# EAGLE design usbMIDI2CV_MC (EAGLE 8.3.2)
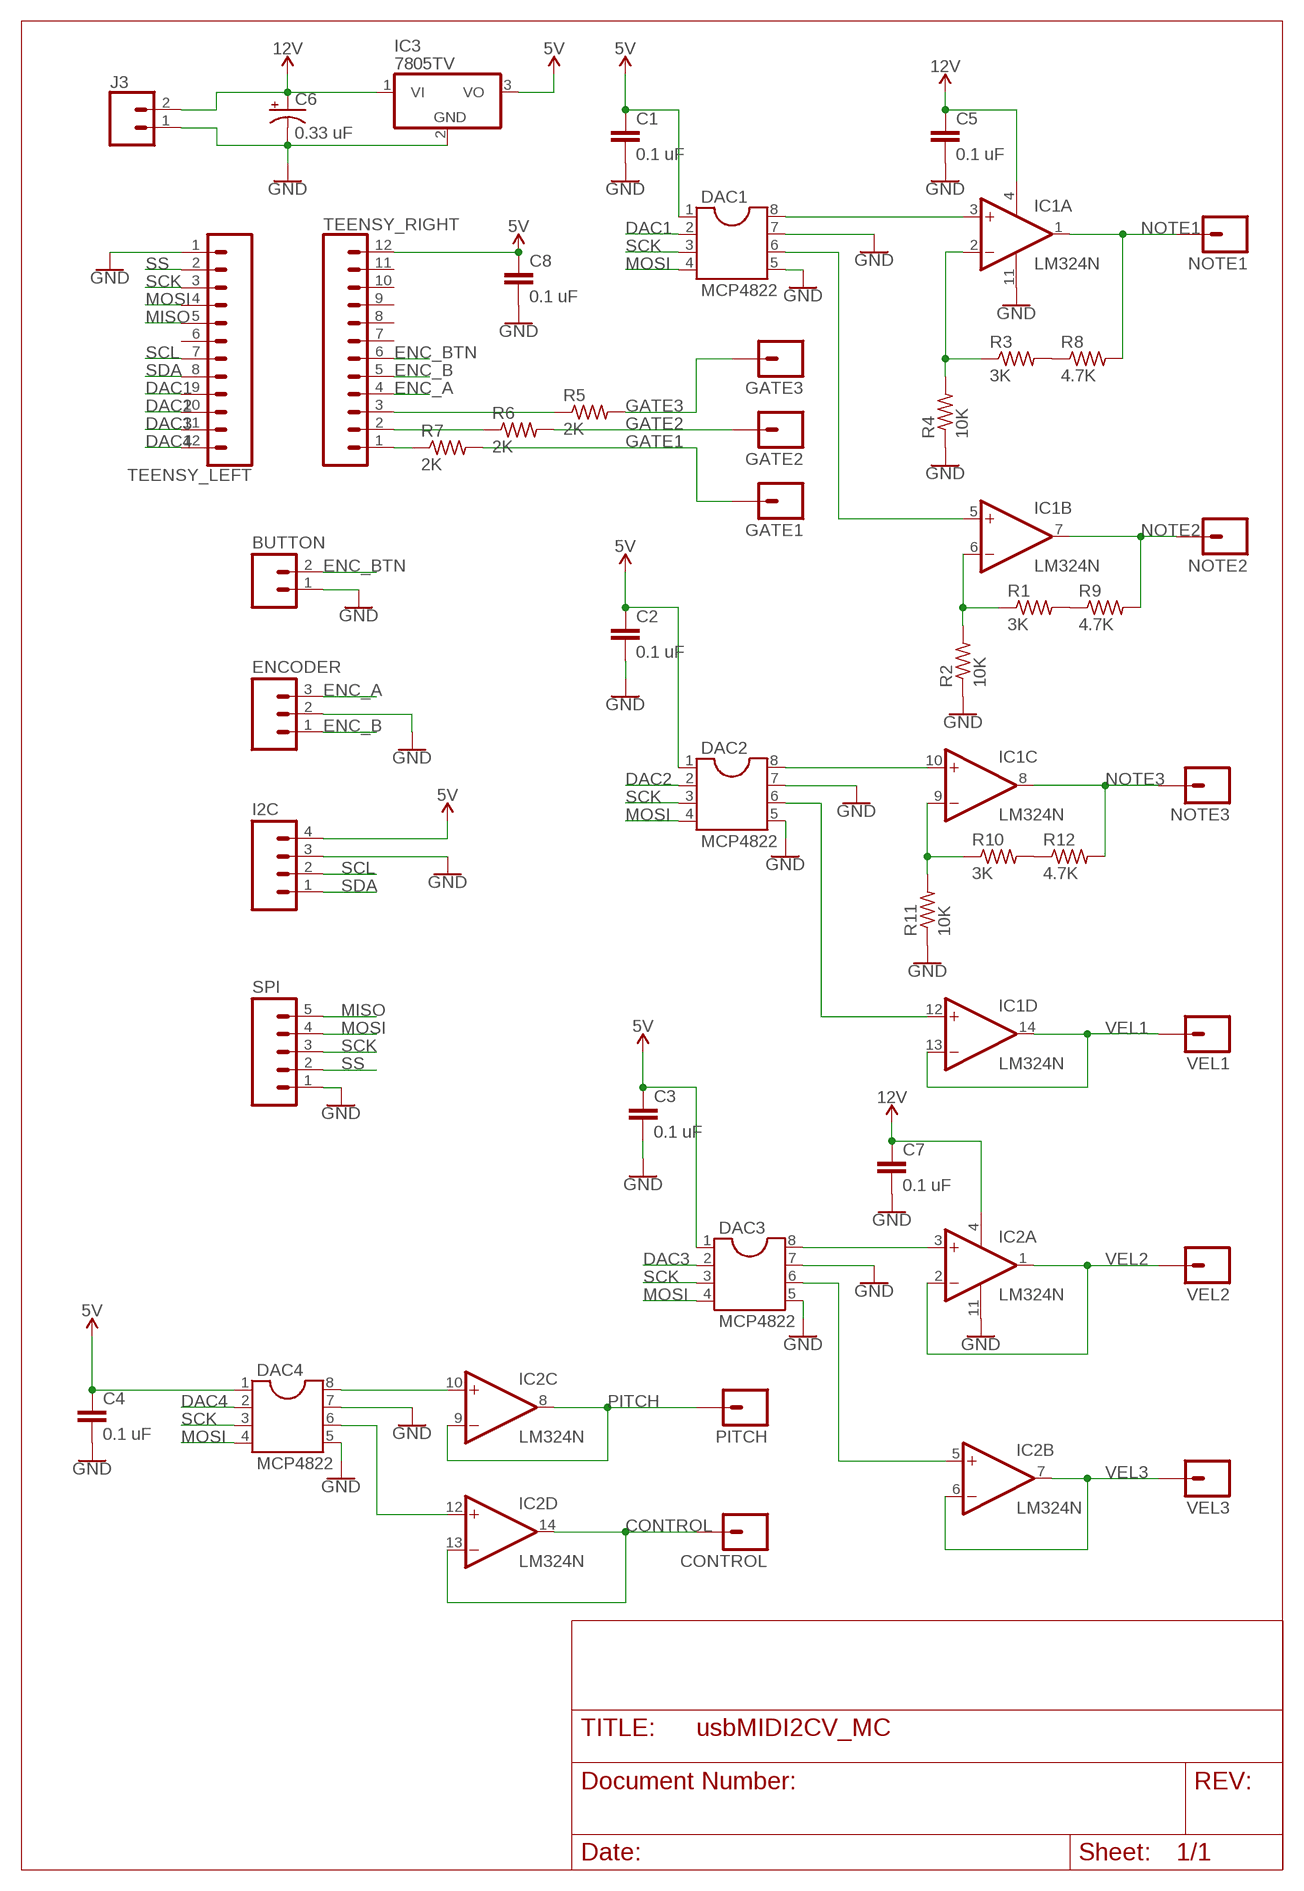
[diagram p0: schematic, sheet 1]

## Parts
BUTTON  M02LOCK_LONGPADS  [1X02_LOCK_LONGPADS]
C1  0.1 uF  CAPPTH  [CAP-PTH-SMALL]
C2  0.1 uF  CAPPTH  [CAP-PTH-SMALL]
C3  0.1 uF  CAPPTH  [CAP-PTH-SMALL]
C4  0.1 uF  CAPPTH  [CAP-PTH-SMALL]
C5  0.1 uF  CAPPTH  [CAP-PTH-SMALL]
C6  0.33 uF  CAP_POLPTH1  [CPOL-RADIAL-100UF-25V]
C7  0.1 uF  CAPPTH  [CAP-PTH-SMALL]
C8  0.1 uF  CAPPTH  [CAP-PTH-SMALL]
CONTROL  M01PTH_NO_SILK_YES_STOP  [1X01_NO_SILK]
DAC1  MCP4822  DIL8S  [SOCKET-08]
DAC2  MCP4822  DIL8S  [SOCKET-08]
DAC3  MCP4822  DIL8S  [SOCKET-08]
DAC4  MCP4822  DIL8S  [SOCKET-08]
ENCODER  M03LONGPADS  [1X03_LONGPADS]
GATE1  M01PTH_NO_SILK_YES_STOP  [1X01_NO_SILK]
GATE2  M01PTH_NO_SILK_YES_STOP  [1X01_NO_SILK]
GATE3  M01PTH_NO_SILK_YES_STOP  [1X01_NO_SILK]
I2C  M04LONGPADS  [1X04_LONGPADS]
IC1  LM324N  [DIL14]
IC2  LM324N  [DIL14]
IC3  7805TV  [TO220V]
J3  CONN_025MM  [SCREWTERMINAL-5MM-2]
NOTE1  M01PTH_NO_SILK_YES_STOP  [1X01_NO_SILK]
NOTE2  M01PTH_NO_SILK_YES_STOP  [1X01_NO_SILK]
NOTE3  M01PTH_NO_SILK_YES_STOP  [1X01_NO_SILK]
PITCH  M01PTH_NO_SILK_YES_STOP  [1X01_NO_SILK]
R1  3K  R-US_0207/10  [0207/10]
R2  10K  R-US_0207/10  [0207/10]
R3  3K  R-US_0207/10  [0207/10]
R4  10K  R-US_0207/10  [0207/10]
R5  2K  R-US_0207/10  [0207/10]
R6  2K  R-US_0207/10  [0207/10]
R7  2K  R-US_0207/10  [0207/10]
R8  4.7K  R-US_0207/10  [0207/10]
R9  4.7K  R-US_0207/10  [0207/10]
R10  3K  R-US_0207/10  [0207/10]
R11  10K  R-US_0207/10  [0207/10]
R12  4.7K  R-US_0207/10  [0207/10]
SPI  M05PTH_LONGPADS  [1X05_LONGPADS]
TEENSY_LEFT  CONN_12  [1X12]
TEENSY_RIGHT  CONN_12  [1X12]
VEL1  M01PTH_NO_SILK_YES_STOP  [1X01_NO_SILK]
VEL2  M01PTH_NO_SILK_YES_STOP  [1X01_NO_SILK]
VEL3  M01PTH_NO_SILK_YES_STOP  [1X01_NO_SILK]

## Nets
5V: C1.1 C2.1 C3.1 C4.1 C8.1 DAC1.1 DAC2.1 DAC3.1 DAC4.1 I2C.4 IC3.3(VO) TEENSY_RIGHT.12
12V: C5.1 C6.1(+) C7.1 IC1.4(P:V+) IC2.4(P:V+) IC3.1(VI) J3.2
CONTROL: CONTROL.1 IC2.13(D:-IN) IC2.14(D:OUT)
DAC1: DAC1.2 TEENSY_LEFT.9
DAC2: DAC2.2 TEENSY_LEFT.10
DAC3: DAC3.2 TEENSY_LEFT.11
DAC4: DAC4.2 TEENSY_LEFT.12
ENC_A: ENCODER.3 TEENSY_RIGHT.4
ENC_B: ENCODER.1 TEENSY_RIGHT.5
ENC_BTN: BUTTON.2 TEENSY_RIGHT.6
GATE1: GATE1.1 R7.2
GATE2: GATE2.1 R6.2
GATE3: GATE3.1 R5.2
GND: BUTTON.1 C1.2 C2.2 C3.2 C4.2 C5.2 C6.2(-) C7.2 C8.2 DAC1.5 DAC1.7 DAC2.5 DAC2.7 DAC3.5 DAC3.7 DAC4.5 DAC4.7 ENCODER.2 I2C.3 IC1.11(P:V-) IC2.11(P:V-) IC3.2(GND) J3.1 R2.1 R4.1 R11.1 SPI.1 TEENSY_LEFT.1
MISO: SPI.5 TEENSY_LEFT.5
MOSI: DAC1.4 DAC2.4 DAC3.4 DAC4.4 SPI.4 TEENSY_LEFT.4
N$1: IC1.6(B:-IN) R1.1 R2.2
N$2: R1.2 R9.1
N$3: IC1.9(C:-IN) R10.1 R11.2
N$4: DAC1.8 IC1.3(A:+IN)
N$5: R3.2 R8.1
N$6: IC1.2(A:-IN) R3.1 R4.2
N$7: DAC1.6 IC1.5(B:+IN)
N$8: DAC2.8 IC1.10(C:+IN)
N$9: DAC2.6 IC1.12(D:+IN)
N$10: R10.2 R12.1
N$11: DAC3.8 IC2.3(A:+IN)
N$12: R5.1 TEENSY_RIGHT.3
N$13: DAC3.6 IC2.5(B:+IN)
N$14: DAC4.6 IC2.12(D:+IN)
N$15: DAC4.8 IC2.10(C:+IN)
N$16: R6.1 TEENSY_RIGHT.2
N$17: R7.1 TEENSY_RIGHT.1
NOTE1: IC1.1(A:OUT) NOTE1.1 R8.2
NOTE2: IC1.7(B:OUT) NOTE2.1 R9.2
NOTE3: IC1.8(C:OUT) NOTE3.1 R12.2
PITCH: IC2.8(C:OUT) IC2.9(C:-IN) PITCH.1
SCK: DAC1.3 DAC2.3 DAC3.3 DAC4.3 SPI.3 TEENSY_LEFT.3
SCL: I2C.2 TEENSY_LEFT.7
SDA: I2C.1 TEENSY_LEFT.8
SS: SPI.2 TEENSY_LEFT.2
VEL1: IC1.13(D:-IN) IC1.14(D:OUT) VEL1.1
VEL2: IC2.1(A:OUT) IC2.2(A:-IN) VEL2.1
VEL3: IC2.6(B:-IN) IC2.7(B:OUT) VEL3.1
Unconnected: TEENSY_LEFT.6 TEENSY_RIGHT.7 TEENSY_RIGHT.8 TEENSY_RIGHT.9 TEENSY_RIGHT.10 TEENSY_RIGHT.11

## Library data of the parts
BUTTON = SparkFun-Connectors:M02: Standard 2-pin 0.1" header. Use with - straight break away headers ( PRT-00116) - right angle break away headers (PRT-00553) - swiss pins (PRT-00743) - machine pins (PRT-00117) - female headers (PRT-00115) Molex polarized connector foot print use with: PRT-08233 with associated crimp pins and housings. 2.54_SCREWTERM for use with PRT-10571. 3.5mm Screw Terminal footprints for PRT-08084 5mm Screw Terminal footprints for use with PRT-08432
C1-C5 C7 C8 = SparkFun-Capacitors:CAP: Capacitor Standard 0603 ceramic capacitor, and 0.1" leaded capacitor.
C6 = SparkFun-Capacitors:CAP_POL: Capacitor Polarized These are standard SMD and PTH capacitors. Normally 10uF, 47uF, and 100uF in electrolytic and tantalum varieties. Always verify the external diameter of the through hole cap, it varies with capacity, voltage, and manufacturer. The EIA devices should be standard.
CONTROL GATE1-GATE3 NOTE1-NOTE3 PITCH VEL1-VEL3 = SparkFun-Connectors:M01: Header 1 Standard 1-pin 0.1" header. Use with straight break away headers (SKU : PRT-00116), right angle break away headers (PRT-00553), swiss pins (PRT-00743), machine pins (PRT-00117), and female headers (PRT-00115). SMTSO-256-ET is a "flush mount" nut for a 4-40 screw. The older package used to be too tight, and did not allow it to sit properly thru the drill hit. The latest (0.165DIA) fits nice and snug.
DAC1-DAC4 = ic-package:DIL8: Dual In Line / Socket
ENCODER = SparkFun-Connectors:M03: Header 3 Standard 3-pin 0.1" header. Use with straight break away headers (SKU : PRT-00116), right angle break away headers (PRT-00553), swiss pins (PRT-00743), machine pins (PRT-00117), and female headers (PRT-00115). Molex polarized connector foot print use with SKU : PRT-08232 with associated crimp pins and housings.
I2C = SparkFun-Connectors:M04: Header 4 Standard 4-pin 0.1" header. Use with straight break away headers (SKU : PRT-00116), right angle break away headers (PRT-00553), swiss pins (PRT-00743), machine pins (PRT-00117), and female headers (PRT-00115). Molex polarized connector foot print use with SKU : PRT-08231 with associated crimp pins and housings. 1MM SMD Version SKU: PRT-10208; PROD_ID: CONN-09696
IC1 IC2 = linear:LM324: OP AMP
IC3 = linear:78*: Positive VOLTAGE REGULATOR Source: http://cache.national.com/ds/LM/LM78L05.pdf http://www.fairchildsemi.com/ds/LM/LM7805.pdf
J3 = SparkFun-Connectors:CONN_02: Multi connection point. Often used as Generic Header-pin footprint for 0.1 inch spaced/style header connections On any of the 0.1 inch spaced packages, you can populate with these: Break Away Headers - Straight <https://www.sparkfun.com/products/116> (PRT-00116) Break Away Male Headers - Right Angle <https://www.sparkfun.com/products/553> (PRT-00553) Female Headers <https://www.sparkfun.com/products/115> (PRT-00115) Break Away Headers - Machine Pin <https://www.sparkfun.com/products/117> (PRT-00117) Break Away Female Headers - Swiss Machine Pin <https://www.sparkfun.com/products/743> (PRT-00743) For SCREWTERMINALS and SPRING TERMINALS visit here: Screw Terimnals on SparkFun.com <https://www.sparkfun.com/search/results?term=Screw+Terminals> (5mm/3.5mm/2.54mm spacing) This device is also useful as a general connection point to wire up your design to another part of your project. Our various solder wires solder well into these plated through hole pads. Hook-Up Wire - Assortment (Stranded, 22 AWG) <https://www.sparkfun.com/products/11375> (PRT-11375) Hook-Up Wire - Assortment (Solid Core, 22 AWG) <https://www.sparkfun.com/products/11367> (PRT-11367) View the entire wire category on our website here <https://www.sparkfun.com/categories/141> Special notes: Molex polarized connector foot print use with: PRT-08233 with associated crimp pins and housings. 2.54_SCREWTERM for use with PRT-10571. 3.5mm Screw Terminal footprints for PRT-08084 5mm Screw Terminal footprints for use with PRT-08432; SF_SKU: PRT-08432
R1-R12 = resistor:R-US_: RESISTOR, American symbol
SPI = SparkFun-Connectors:M05: Header 5 Standard 5-pin 0.1" header. Use with straight break away headers (SKU : PRT-00116), right angle break away headers (PRT-00553), swiss pins (PRT-00743), machine pins (PRT-00117), and female headers (PRT-00115). Molex polarized connector foot print use with SKU : PRT-08230 with associated crimp pins and housings.
TEENSY_LEFT TEENSY_RIGHT = SparkFun-Connectors:CONN_12: Multi connection point. Often used as Generic Header-pin footprint for 0.1 inch spaced/style header connections On any of the 0.1 inch spaced packages, you can populate with these: Break Away Headers - Straight <https://www.sparkfun.com/products/116> (PRT-00116) Break Away Male Headers - Right Angle <https://www.sparkfun.com/products/553> (PRT-00553) Female Headers <https://www.sparkfun.com/products/115> (PRT-00115) Break Away Headers - Machine Pin <https://www.sparkfun.com/products/117> (PRT-00117) Break Away Female Headers - Swiss Machine Pin <https://www.sparkfun.com/products/743> (PRT-00743) For SCREWTERMINALS and SPRING TERMINALS visit here: Screw Terimnals on SparkFun.com <https://www.sparkfun.com/search/results?term=Screw+Terminals> (5mm/3.5mm/2.54mm spacing) This device is also useful as a general connection point to wire up your design to another part of your project. Our various solder wires solder well into these plated through hole pads. Hook-Up Wire - Assortment (Stranded, 22 AWG) <https://www.sparkfun.com/products/11375> (PRT-11375) Hook-Up Wire - Assortment (Solid Core, 22 AWG) <https://www.sparkfun.com/products/11367> (PRT-11367) View the entire wire category on our website here <https://www.sparkfun.com/categories/141> Special notes: Molex polarized connector foot print use with SKU : PRT-08231 with associated crimp pins and housings. 1MM SMD Version SKU: PRT-10208 NOTES ON THE VARIANTS LOCK and LOCK_LONGPADS... This footprint was designed to help hold the alignment of a through-hole component (i.e. 6-pin header) while soldering it into place. You may notice that each hole has been shifted either up or down by 0.005 of an inch from it's more standard position (which is a perfectly straight line). This slight alteration caused the pins (the squares in the middle) to touch the edges of the holes. Because they are alternating, it causes a "brace" to hold the component in place. 0.005 has proven to be the perfect amount of "off-center" position when using our standard breakaway headers. Although looks a little odd when you look at the bare footprint, once you have a header in there, the alteration is very hard to notice. Also,if you push a header all the way into place, it is covered up entirely on the bottom side.

## Board
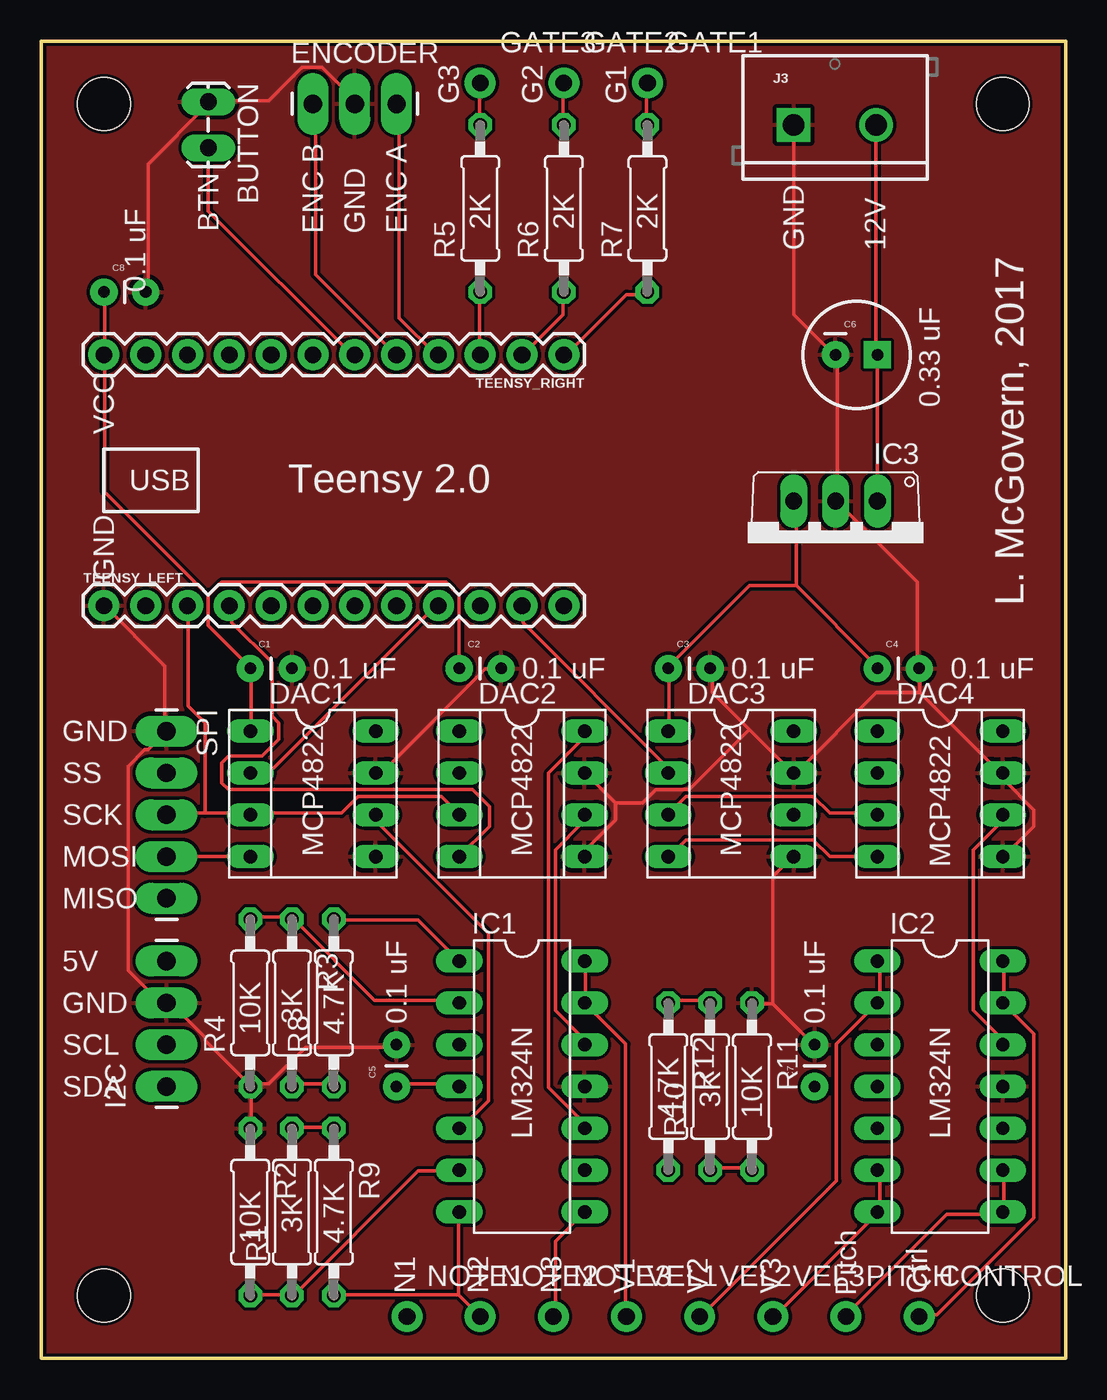
[diagram p1: board, top side]
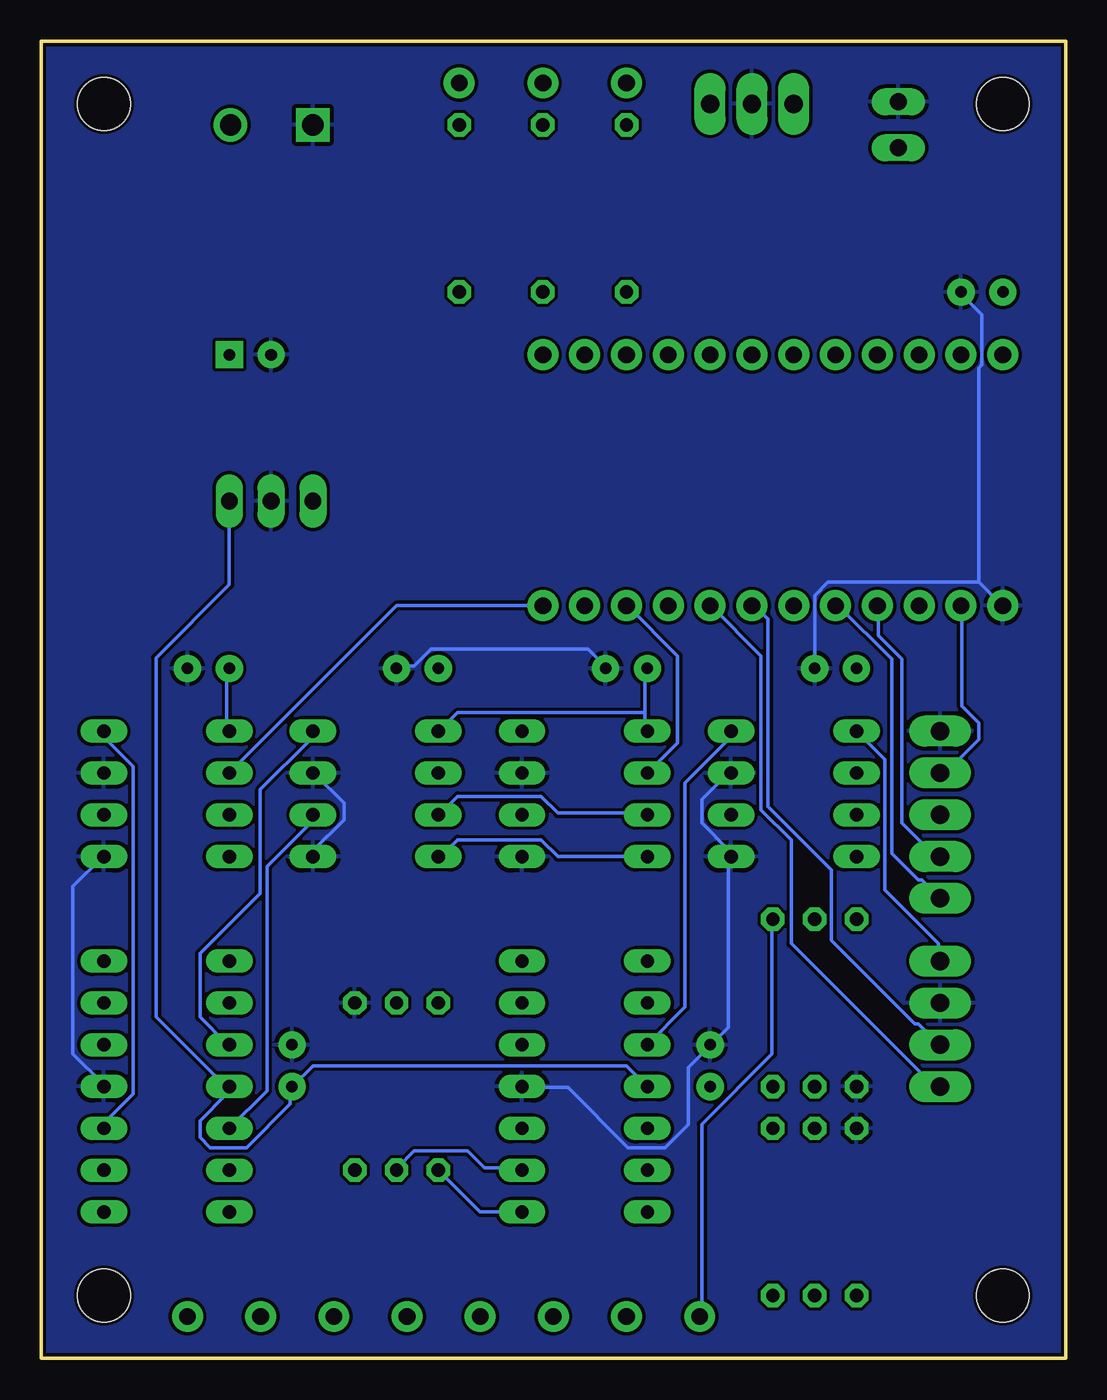
[diagram p2: board, bottom side, seen from below]

Size 62.23 x 80.01 mm. Coordinates in mm from the lower left corner, seen from the top.
Outline: 3.81,0 62.23,0
Outline: 62.23,0 0,0 0,80.01 62.23,80.01 62.23,0
Copper layers (1*16): Top 0.035mm / dielectric 1.5mm / Bottom 0.035mm
Design rules "SparkFun": minimum track width 8mil, minimum drill 20mil, track to track 8mil, track to pad 8mil, pad to pad 8mil, via to via 8mil, smd to smd 8mil, copper to edge 8mil, drill to drill 8mil, minimum pad ring 12mil, minimum via ring 10mil, stop-mask expansion 4mil, vias tented up to drill 20mil, thermal gap 10mil
Holes 3.2 mm at 3.81,3.81 58.42,3.81 58.42,76.2 3.81,76.2

### Footprints (pad centres in the part's own frame; a part is rotated, then mirrored left to right if it is on the bottom)
1X02_LOCK_LONGPADS = drill 1.016 long: 1 -0.127,0; 2 2.667,0
CAP-PTH-SMALL = drill 0.7 pad 1.651: 1 0,0; 2 2.54,0
CPOL-RADIAL-100UF-25V = drill 0.7 pad 1.651 square: 1 1.27,0 | drill 0.7 pad 1.651: 2 -1.27,0
1X01_NO_SILK = drill 1.016 pad 1.88: 1 0,0
SOCKET-08 = drill 0.813 long: 1 -3.81,-3.81; 2 -1.27,-3.81; 3 1.27,-3.81; 4 3.81,-3.81; 5 3.81,3.81; 6 1.27,3.81; 7 -1.27,3.81; 8 -3.81,3.81
1X03_LONGPADS = drill 1.118 pad 1.88 long: 1 0,0; 2 2.54,0; 3 5.08,0
1X04_LONGPADS = drill 1.118 pad 1.88 long: 1 0,0; 2 2.54,0; 3 5.08,0; 4 7.62,0
DIL14 = drill 0.813 long: 1 -7.62,-3.81; 2 -5.08,-3.81; 3 -2.54,-3.81; 4 0,-3.81; 5 2.54,-3.81; 6 5.08,-3.81; 7 7.62,-3.81; 8 7.62,3.81; 9 5.08,3.81; 10 2.54,3.81; 11 0,3.81; 12 -2.54,3.81; 13 -5.08,3.81; 14 -7.62,3.81
TO220V = drill 1.016 long: 1 -2.54,-2.54; 2 0,-2.54; 3 2.54,-2.54
SCREWTERMINAL-5MM-2 = drill 1.3 pad 2.032 square: 1 0,0 | drill 1.3 pad 2.032: 2 5,0
0207/10 = drill 0.813 octagon: 1 -5.08,0; 2 5.08,0
1X05_LONGPADS = drill 1.118 pad 1.88 long: 1 0,0; 2 2.54,0; 3 5.08,0; 4 7.62,0; 5 10.16,0
1X12 = drill 1.016 pad 1.88: 1 0,0; 2 2.54,0; 3 5.08,0; 4 7.62,0; 5 10.16,0; 6 12.7,0; 7 15.24,0; 8 17.78,0; 9 20.32,0; 10 22.86,0; 11 25.4,0; 12 27.94,0

### Placement (x,y rotation side)
BUTTON  10.16,76.2 270 top
C1  12.7,41.91 0 top
C2  25.4,41.91 0 top
C3  38.1,41.91 0 top
C4  50.8,41.91 0 top
C5  21.59,16.51 90 top
C6  49.53,60.96 0 top
C7  46.99,16.51 90 top
C8  3.81,64.77 0 top
CONTROL  53.34,2.54 0 top
DAC1  16.51,34.29 270 top
DAC2  29.21,34.29 270 top
DAC3  41.91,34.29 270 top
DAC4  54.61,34.29 270 top
ENCODER  16.51,76.2 0 top
GATE1  36.83,77.47 0 top
GATE2  31.75,77.47 0 top
GATE3  26.67,77.47 0 top
I2C  7.62,16.51 90 top
IC1  29.21,16.51 270 top
IC2  54.61,16.51 270 top
IC3  48.26,49.53 180 top
J3  45.72,74.93 0 top
NOTE1  22.23,2.54 0 top
NOTE2  26.67,2.54 0 top
NOTE3  31.11,2.54 0 top
PITCH  48.9,2.54 0 top
R1  15.24,8.89 90 top
R2  12.7,8.89 270 top
R3  15.24,21.59 270 top
R4  12.7,21.59 90 top
R5  26.67,69.85 90 top
R6  31.75,69.85 90 top
R7  36.83,69.85 90 top
R8  17.78,21.59 90 top
R9  17.78,8.89 270 top
R10  40.64,16.51 90 top
R11  43.18,16.51 270 top
R12  38.1,16.51 270 top
SPI  7.62,38.1 270 top
TEENSY_LEFT  3.81,45.72 0 top
TEENSY_RIGHT  31.75,60.96 180 top
VEL1  35.56,2.54 0 top
VEL2  40.01,2.54 0 top
VEL3  44.45,2.54 0 top

### Tracks (layer width: path | path; a pad name or v marks a point on that pad's centre or on a via)
5V
  Top 0.203: DAC3.1 38.15,38.2 38.15,41.86 C3.1 38.15,42.06 43.03,46.94 45.87,46.94 | DAC1.1 12.75,38.2 12.75,41.86 C1.1 12.6,42.06 10.16,44.5 10.16,46.33 | 45.87,46.94 45.87,52.02 IC3.3 | 45.87,46.94 50.75,42.06 C4.1 | 3.86,60.96 3.86,64.62 C8.1 | 3.86,60.96 3.86,52.63 10.16,46.33 | 3.86,60.96 TEENSY_RIGHT.12 | C2.1 25.4,46.33 24.59,47.14 10.97,47.14 10.16,46.33
  Bottom 0.203: DAC4.1 50.95,38.2 50.95,41.86 C4.1 | 25.55,39.22 25.55,41.86 C2.1 | 25.55,39.22 25.55,38.2 DAC2.1 | 25.55,39.22 36.93,39.22 37.95,38.2 DAC3.1 | DAC1.1 10.97,36.37 10.97,28.45 7.72,25.2 7.72,24.18 I2C.4
12V
  Top 0.203: IC1.4 25.35,16.66 21.69,16.66 C5.1 | J3.2 50.72,61.04 C6.1 IC3.1
  Bottom 0.203: 50.95,16.46 50.95,16.05 52.58,14.43 52.58,13.41 51.97,12.8 49.73,12.8 47.09,15.44 47.09,16.46 C7.1 45.72,17.78 26.67,17.78 IC1.4 | 50.95,16.46 IC2.4 | IC3.1 50.8,46.99 55.24,42.55 55.24,20.75 50.95,16.46
CONTROL
  Top 0.203: IC2.14 58.47,23.98 58.47,21.74 IC2.13 60.3,19.71 60.3,8.53 54.41,2.64 53.39,2.64 CONTROL.1
DAC1
  Top 0.203: DAC1.2 13.82,35.56 23.98,45.72 TEENSY_LEFT.9
DAC2
  Bottom 0.203: DAC2.2 23.57,37.39 23.57,42.67 26.62,45.72 TEENSY_LEFT.10
DAC3
  Top 0.203: DAC3.2 38,35.56 38,35.97 29.26,44.7 29.26,45.72 TEENSY_LEFT.11
DAC4
  Bottom 0.203: DAC4.2 40.64,45.72 TEENSY_LEFT.12
ENC_A
  Top 0.203: ENCODER.3 21.74,76.2 21.74,63.2 23.98,60.96 TEENSY_RIGHT.4
ENC_B
  Top 0.203: ENCODER.1 16.66,76.2 16.66,65.84 21.54,60.96 TEENSY_RIGHT.5
ENC_BTN
  Top 0.203: BUTTON.2 10.16,69.7 18.9,60.96 TEENSY_RIGHT.6
GATE1
  Top 0.203: R7.2 36.78,74.98 36.78,77.42 GATE1.1
GATE2
  Top 0.203: R6.2 31.7,74.98 31.7,77.42 GATE2.1
GATE3
  Top 0.203: R5.2 26.62,74.98 26.62,77.42 GATE3.1
GND
  Top 0.203: 44.45,21.54 43.23,21.54 R11.1 | 44.45,21.54 46.89,19.1 C7.2 | R2.1 12.75,14.02 12.75,16.46 R4.1 | 34.9,33.73 34.9,32.72 33.07,30.89 33.07,30.48 DAC2.5 | 34.9,33.73 33.07,35.56 DAC2.7 | 43.03,38.2 45.67,35.56 DAC3.7 45.87,35.56 50.75,40.44 53.39,40.44 | 43.03,38.2 40.79,40.44 40.79,41.86 C3.2 | 34.9,33.73 36.52,33.73 37.34,34.54 39.37,34.54 43.03,38.2 | 44.45,21.54 44.45,29.26 45.67,30.48 DAC3.5 | DAC4.5 58.47,30.48 60.3,32.31 60.3,33.33 58.47,35.15 58.47,35.56 DAC4.7 58.27,35.56 53.39,40.44 | 53.39,40.44 53.39,41.86 C4.2 53.24,42.06 53.24,47.14 48.36,52.02 IC3.2 48.36,52.22 48.36,60.96 C6.2 48.16,60.96 45.72,63.4 J3.1 | DAC1.7 20.68,35.56 26.98,41.86 27.79,41.86 C2.2 | TEENSY_LEFT.1 3.86,45.72 7.52,42.06 7.52,38.2 SPI.1 6.5,36.98 6.3,36.98 5.28,35.97 5.28,23.57 7.11,21.74 7.52,21.74 I2C.3 7.72,21.74 9.96,19.51 9.96,19.3 12.6,16.66 R4.1 | ENCODER.2 18.9,76.2 18.9,76.61 17.07,78.44 15.85,78.44 13.82,76.4 10.16,76.4 BUTTON.1 10.16,76.2 6.5,72.54 6.5,64.82 C8.2 | R4.1 12.8,16.66 13.82,16.66 16.05,18.9 21.54,18.9 C5.2
  Bottom 0.203: IC2.11 58.47,16.66 60.3,18.49 60.3,28.65 58.47,30.48 DAC4.5 | IC1.11 32.87,16.46 30.23,16.46 26.57,12.8 24.33,12.8 22.91,14.22 22.91,17.68 21.69,18.9 C5.2 21.49,19.1 20.47,20.12 20.47,30.48 | DAC3.5 45.67,30.48 45.67,30.89 43.84,32.72 43.84,33.73 45.67,35.56 DAC3.7 | 20.47,30.48 20.47,30.89 22.1,32.51 22.1,33.93 20.47,35.56 DAC1.7 | 20.47,30.48 DAC1.5 | C3.2 40.59,42.06 39.57,42.06 38.56,43.08 29.01,43.08 27.99,42.06 C2.2 | C1.2 15.24,46.33 14.43,47.14 5.28,47.14 | 5.28,47.14 3.86,45.72 TEENSY_LEFT.1 | 5.28,47.14 5.28,60.15 5.08,60.35 5.08,63.4 6.3,64.62 C8.2
  pour Top: 0,0 0,80.01 62.23,80.01 62.23,0
  pour Bottom: 0,0 0,80.01 62.23,80.01 62.23,0
MISO
  Bottom 0.203: SPI.5 8.74,29.06 8.94,29.06 10.57,30.68 10.57,42.47 13.82,45.72 TEENSY_LEFT.5
MOSI
  Top 0.203: DAC4.4 47.9,30.48 46.89,31.5 39.17,31.5 38.15,30.48 DAC3.4 | SPI.4 DAC1.4 | DAC2.4 27.23,32.31 27.23,33.53 26.21,34.54 11.38,34.54 10.97,34.95 10.97,36.17 11.38,36.58 13.41,36.58 14.43,37.59 14.43,38.61 14.02,39.01 14.02,42.27 11.58,44.7 11.58,45.72 TEENSY_LEFT.4
  Bottom 0.203: DAC2.4 30.84,30.48 31.85,31.5 36.93,31.5 37.95,30.48 DAC3.4 | SPI.4 7.92,30.48 9.96,32.51 9.96,42.47 11.38,43.89 11.38,45.72 TEENSY_LEFT.4
N$1
  Top 0.203: R2.2 12.75,3.86 15.19,3.86 R1.1 15.39,3.86 22.91,11.38 25.35,11.38 IC1.6
N$2
  Top 0.203: R1.2 15.39,14.02 17.63,14.02 R9.1
N$3
  Top 0.203: R11.2 43.03,11.58 40.79,11.58 R10.1
  Bottom 0.203: IC1.9 33.07,11.58 35.31,11.58 36.32,12.6 39.57,12.6 40.59,11.58 R10.1
N$4
  Bottom 0.203: IC1.3 23.11,21.34 23.11,34.95 20.47,37.59 20.47,38 DAC1.8
N$5
  Top 0.203: R3.2 15.39,16.66 17.63,16.66 R8.1
N$6
  Top 0.203: R4.2 12.75,26.82 15.19,26.82 R3.1 15.39,26.62 20.27,21.74 25.35,21.74 IC1.2
N$7
  Top 0.203: DAC1.6 20.47,32.92 20.47,32.51 27.18,25.81 27.18,15.65 25.55,14.02 IC1.5
N$8
  Top 0.203: IC1.10 32.87,14.02 32.87,14.43 30.84,16.46 30.84,35.56 32.87,37.59 32.87,38 DAC2.8
N$9
  Top 0.203: IC1.12 32.87,19.1 32.87,19.51 31.24,21.13 31.24,30.89 32.87,32.51 32.87,32.92 DAC2.6
N$10
  Top 0.203: R12.1 38.15,21.74 40.59,21.74 R10.2
N$11
  Bottom 0.203: IC2.3 50.95,19.1 52.58,20.73 52.58,24.59 48.92,28.25 48.92,34.54 45.87,37.59 45.87,38 DAC3.8
N$12
  Top 0.203: R5.1 26.62,64.62 26.62,60.96 TEENSY_RIGHT.3
N$13
  Bottom 0.203: IC2.5 48.51,16.26 48.51,29.87 45.87,32.51 45.87,32.92 DAC3.6
N$14
  Top 0.203: IC2.12 58.27,19.1 58.27,19.51 56.64,21.13 56.64,30.89 58.27,32.51 58.27,32.92 DAC4.6
N$15
  Bottom 0.203: IC2.10 58.27,14.02 58.27,14.43 56.64,16.05 56.64,35.97 58.27,37.59 58.27,38 DAC4.8
N$16
  Top 0.203: R6.1 31.7,64.62 31.7,63.4 29.26,60.96 TEENSY_RIGHT.2
N$17
  Top 0.203: R7.1 36.78,64.62 35.56,64.62 31.9,60.96 TEENSY_RIGHT.1
NOTE1
  Top 0.203: IC1.1 22.91,26.62 17.83,26.62 R8.2
  Bottom 0.203: NOTE1.1 22.1,2.64 22.1,14.22 17.83,18.49 17.83,26.62 R8.2
NOTE2
  Top 0.203: 25.35,3.86 17.83,3.86 R9.2 | NOTE2.1 25.35,3.86 | 25.35,3.86 25.35,8.74 IC1.7
NOTE3
  Top 0.203: IC1.8 31.24,7.11 31.24,2.64 NOTE3.1
  Bottom 0.203: R12.2 35.56,8.89 IC1.8
PITCH
  Top 0.203: IC2.9 58.47,11.38 58.47,8.94 IC2.8 58.27,8.74 55.02,8.74 48.92,2.64 PITCH.1
SCK
  Top 0.203: DAC4.3 50.75,33.12 47.9,33.12 46.89,34.14 39.17,34.14 38.15,33.12 DAC3.3 | DAC2.3 25.35,33.12 24.33,34.14 19.25,34.14 18.24,33.12 12.75,33.12 DAC1.3 12.6,33.12 9.96,33.12 | 9.96,33.12 7.72,33.12 SPI.3 | 9.96,33.12 9.96,38.61 8.94,39.62 8.94,45.72 TEENSY_LEFT.3
  Bottom 0.203: DAC2.3 25.55,33.12 30.84,33.12 31.85,34.14 36.93,34.14 37.95,33.12 DAC3.3
SCL
  Bottom 0.203: I2C.2 7.72,19.1 8.94,20.32 9.14,20.32 14.22,25.4 14.22,29.67 18.09,33.53 18.09,44.91 18.9,45.72 TEENSY_LEFT.7
SDA
  Bottom 0.203: I2C.1 7.72,16.66 8.13,16.66 16.66,25.2 16.66,31.5 18.49,33.33 18.49,42.67 21.54,45.72 TEENSY_LEFT.8
SS
  Bottom 0.203: SPI.2 7.32,35.56 5.28,37.59 5.28,38.61 6.3,39.62 6.3,45.72 TEENSY_LEFT.2
VEL1
  Top 0.203: IC1.14 33.07,23.98 33.07,21.74 IC1.13 35.51,19.1 35.51,2.64 VEL1.1
VEL2
  Top 0.203: IC2.1 50.95,23.98 50.95,21.74 IC2.2 48.31,19.1 48.31,10.77 40.18,2.64 VEL2.1
VEL3
  Top 0.203: IC2.6 50.95,11.38 50.95,8.94 IC2.7 50.75,8.74 44.45,2.44 VEL3.1

### Text on the board
tPlace: G3 | G2 | G1 | 2K | 2K | 2K | BTN | ENC B | GND | ENC A | GND | 12V | 0.1 uF | 0.33 uF | VCC | USB | Teensy 2.0 | GND | L. McGovern, 2017 | 0.1 uF | 0.1 uF | 0.1 uF | 0.1 uF | GND | SS | SCK | MOSI | MCP4822 | MCP4822 | MCP4822 | MCP4822 | MISO | 5V | GND | 10K | 3K | 4.7K | 0.1 uF | 0.1 uF | SCL | SDA | 4.7K | 3K | 10K | LM324N | LM324N | 3K | 10K | 4.7K | N1 | N2 | N3 | V1 | V2 | V3 | Pitch | Ctrl